# Altium schematic sheet BSU_Comm.SchDoc: Communication
size A4; Sub Team: EEE; Organization: PERT; SheetNumber: 4; SheetTotal: 8
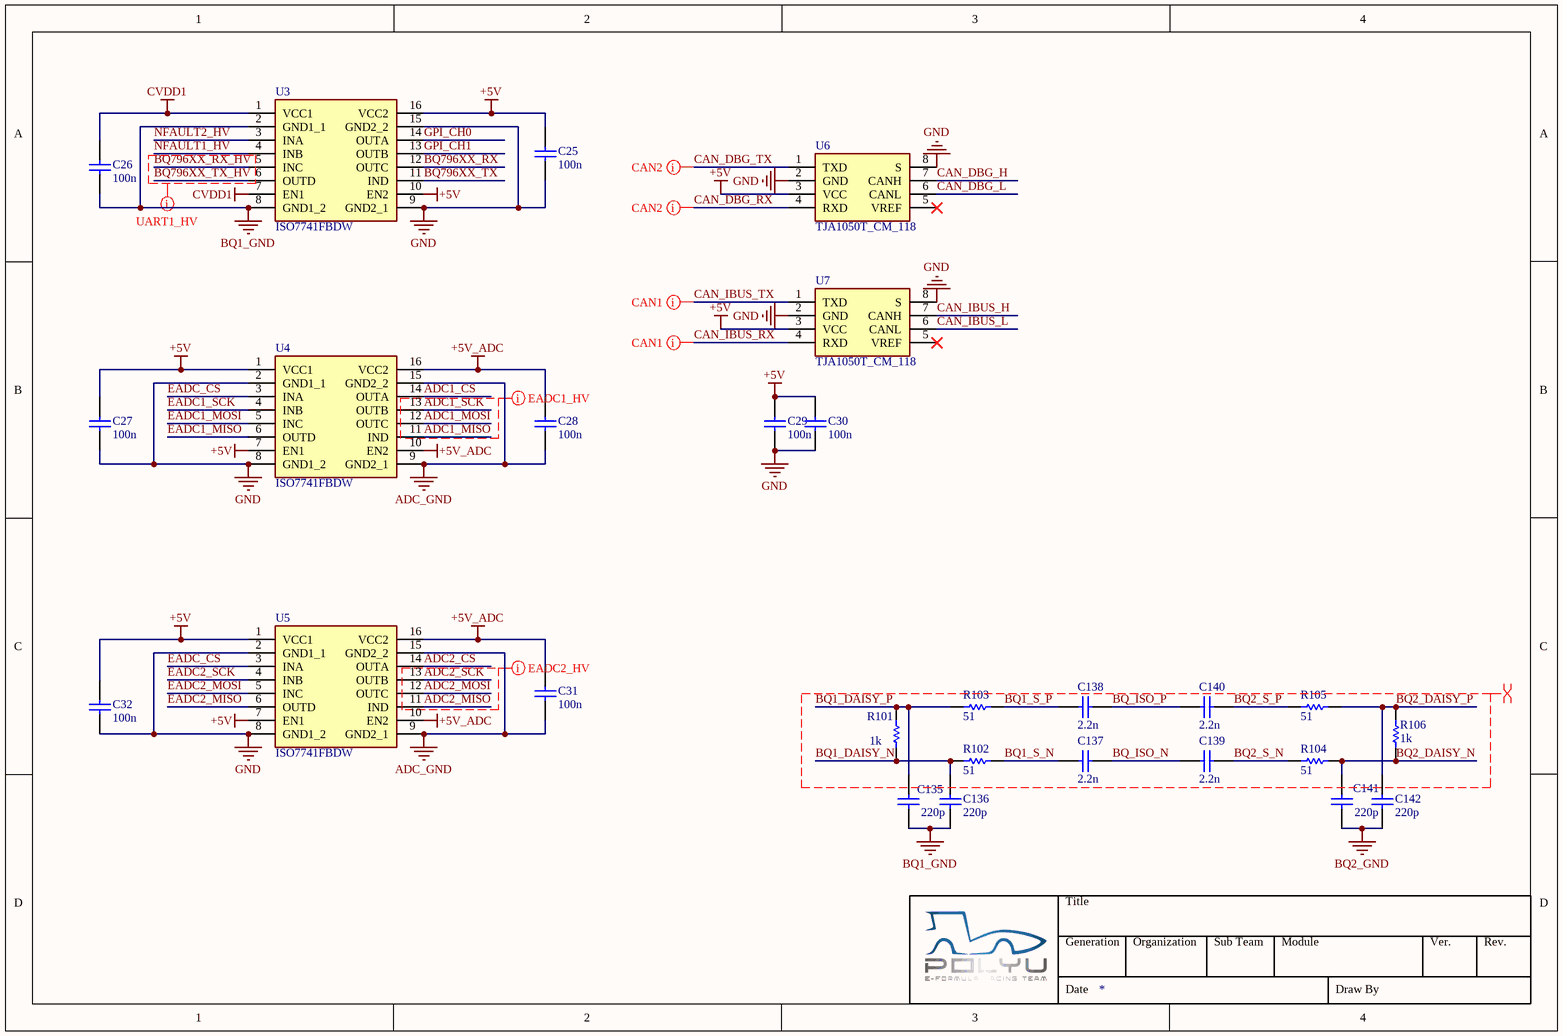
[diagram p0: BSU_Comm.SchDoc]

## Parts
C25  100n  [0805_SMD_C]
C26  100n  [0805_SMD_C]
C27  100n  [0805_SMD_C]
C28  100n  [0805_SMD_C]
C29  100n  [0805_SMD_C]
C30  100n  [0805_SMD_C]
C31  100n  [0805_SMD_C]
C32  100n  [0805_SMD_C]
C135  220p  [0603_SMD_C]
C136  220p  [0603_SMD_C]
C137  2.2n  [0603_SMD_C]
C138  2.2n  [0603_SMD_C]
C139  2.2n  [0603_SMD_C]
C140  2.2n  [0603_SMD_C]
C141  220p  [0603_SMD_C]
C142  220p  [0603_SMD_C]
R101  1k  [0603_SMD_R]
R102  51  [0603_SMD_R]
R103  51  [0603_SMD_R]
R104  51  [0603_SMD_R]
R105  51  [0603_SMD_R]
R106  1k  [0603_SMD_R]
U3  ISO7741FBDW  [SOIC16_ISO7741]
U4  ISO7741FBDW  [SOIC16_ISO7741]
U5  ISO7741FBDW  [SOIC16_ISO7741]
U6  TJA1050T_CM_118  [SOIC8_TJA1050]
U7  TJA1050T_CM_118  [SOIC8_TJA1050]

## Nets
+5V: C25.2 C27.2 C29.2 C30.2 C32.2 U3.10(EN2) U3.16(VCC2) U4.1(VCC1) U4.7(EN1) U5.1(VCC1) U5.7(EN1) U6.3(VCC) U7.3(VCC)
+5V_ADC: C28.2 C31.2 U4.10(EN2) U4.16(VCC2) U5.10(EN2) U5.16(VCC2)
ADC_GND: C28.1 C31.1 U4.9(GND2_1) U4.15(GND2_2) U5.9(GND2_1) U5.15(GND2_2)
BQ1_GND: C26.1 C135.1 C136.1 U3.2(GND1_1) U3.8(GND1_2)
BQ2_GND: C141.1 C142.1
CVDD1: C26.2 U3.1(VCC1) U3.7(EN1)
GND: C25.1 C27.1 C29.1 C30.1 C32.1 U3.9(GND2_1) U3.15(GND2_2) U4.2(GND1_1) U4.8(GND1_2) U5.2(GND1_1) U5.8(GND1_2) U6.2(GND) U6.8(S) U7.2(GND) U7.8(S)
ADC1_CS: U4.14(OUTA)
ADC1_MISO: U4.11(IND)
ADC1_MOSI: U4.12(OUTC)
ADC1_SCK: U4.13(OUTB)
ADC2_CS: U5.14(OUTA)
ADC2_MISO: U5.11(IND)
ADC2_MOSI: U5.12(OUTC)
ADC2_SCK: U5.13(OUTB)
BQ1_DAISY_N: C136.2 R101.2 R102.2
BQ1_DAISY_P: C135.2 R101.1 R103.2
BQ1_S_N: C137.2 R102.1
BQ1_S_P: C138.2 R103.1
BQ2_DAISY_N: C141.2 R104.2 R106.1
BQ2_DAISY_P: C142.2 R105.2 R106.2
BQ2_S_N: C139.2 R104.1
BQ2_S_P: C140.2 R105.1
BQ796XX_RX: U3.12(OUTC)
BQ796XX_RX_HV: U3.5(INC)
BQ796XX_TX: U3.11(IND)
BQ796XX_TX_HV: U3.6(OUTD)
BQ_ISO_N: C137.1 C139.1
BQ_ISO_P: C138.1 C140.1
CAN_DBG_H: U6.7(CANH)
CAN_DBG_L: U6.6(CANL)
CAN_DBG_RX: U6.4(RXD)
CAN_DBG_TX: U6.1(TXD)
CAN_IBUS_H: U7.7(CANH)
CAN_IBUS_L: U7.6(CANL)
CAN_IBUS_RX: U7.4(RXD)
CAN_IBUS_TX: U7.1(TXD)
EADC1_MISO: U4.6(OUTD)
EADC1_MOSI: U4.5(INC)
EADC1_SCK: U4.4(INB)
EADC2_MISO: U5.6(OUTD)
EADC2_MOSI: U5.5(INC)
EADC2_SCK: U5.4(INB)
EADC_CS: U4.3(INA) U5.3(INA)
GPI_CH0: U3.14(OUTA)
GPI_CH1: U3.13(OUTB)
NFAULT1_HV: U3.4(INB)
NFAULT2_HV: U3.3(INA)

Not connected (* = marked no-connect by the designer): U6 5(VREF)*; U7 5(VREF)*

## Layout directives
differential pair; differential pair class BQ_DAISY; net class BQ_DAISY: BQ1_DAISY_N, BQ1_DAISY_P, BQ1_S_N, BQ1_S_P, BQ2_DAISY_N, BQ2_DAISY_P, BQ2_S_N, BQ2_S_P, BQ_ISO_N, BQ_ISO_P
net class UART1_HV; rule Matched Net Lengths [Tolerance = 1mm]: BQ796XX_RX_HV, BQ796XX_TX_HV
net class EADC1_HV; rule Matched Net Lengths [Tolerance = 1mm]: ADC1_MISO, ADC1_MOSI, ADC1_SCK
net class EADC2_HV; rule Matched Net Lengths [Tolerance = 1mm]: ADC2_MISO, ADC2_MOSI, ADC2_SCK
net class CAN2; rule Matched Net Lengths [Tolerance = 1mm]: CAN_DBG_RX, CAN_DBG_TX
net class CAN1; rule Matched Net Lengths [Tolerance = 1mm]: CAN_IBUS_RX, CAN_IBUS_TX

## Notes on the sheet
- Title
- Generation
- Organization
- Sub Team
- Module
- Ver.
- Rev.
- Date
- Draw By

## Library data of the parts
C25-C32 = 0805_SMD_Capacitor: 0805 SMD Capacitor; Voltage Rating: 16VDC; Tolerance: *; Dielectric: *; Value: 100n
C135 C136 C141 C142 = 0603_SMD_Capacitor: 0603 SMD Capacitor; Voltage Rating: 50VDC; Tolerance: *; Dielectric: *; Value: 220p
C137-C140 = 0603_SMD_Capacitor: 0603 SMD Capacitor; Voltage Rating: 100VDC; Tolerance: *; Dielectric: *; Value: 2.2n
R101-R106 = 0603_SMD_Resistor: 0603 SMD Resistor; Tolerance: *; Power Rating: *; Temperature Coefficient: *
  R101 R106: Value: 1k
  R102-R105: Value: 51
U3-U5 = ISO7741FBDW: Digital Isolators Robust EMC, quad-channel, 3/1, reinforced digital isolator 16-SOIC -55 to 125; Manufacturer_Name: Texas Instruments; Geometry.Height: 2.65mm; Mouser Part Number: 595-ISO7741FBDW; Mouser Price/Stock: https://www.mouser.co.uk/ProductDetail/Texas-Instruments/ISO7741FBDW?qs=MLItCLRbWsxUdn9iEHVJVg%3D%3D; Manufacturer_Part_Number: ISO7741FBDW; Datasheet Link: https://www.ti.com/lit/gpn/iso7741
U6 U7 = TJA1050T: NXP - TJA1050T/CM,118 - CAN TRANSCEIVER, 1TX/RX, SOIC-8; Geometry.Height: 1.75mm; Mouser Part Number: 771-TJA1050T/CM118; Mouser Price/Stock: https://www.mouser.co.uk/ProductDetail/NXP-Semiconductors/TJA1050T-CM118?qs=5XOdhvmYM0NFFspw0VP5sA%3D%3D; Manufacturer_Name: NXP; Manufacturer_Part_Number: TJA1050T/CM,118; Datasheet Link: http://www.nxp.com/docs/en/data-sheet/TJA1050.pdf